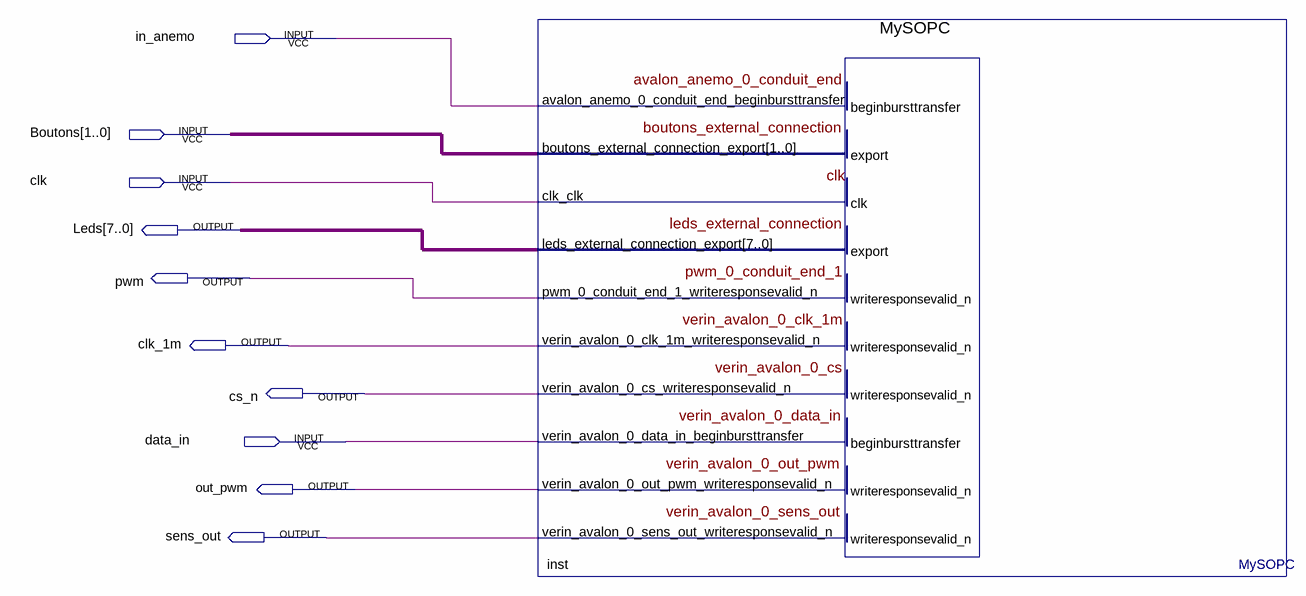
[diagram p0: schematic sheet]
// Quartus schematic Mon_Sopc.bdf as structural Verilog: 1 symbols, 10 pins
module Mon_Sopc (
  input  in_anemo,
  input  [1:0] Boutons,
  input  clk,
  input  data_in,
  output [7:0] Leds,
  output pwm,
  output clk_1m,
  output cs_n,
  output out_pwm,
  output sens_out
);

  MySOPC inst (
    .avalon_anemo_0_conduit_end_beginbursttransfer(in_anemo), .boutons_external_connection_export(Boutons),
    .clk_clk(clk), .verin_avalon_0_data_in_beginbursttransfer(data_in),
    .leds_external_connection_export(Leds), .pwm_0_conduit_end_1_writeresponsevalid_n(pwm),
    .verin_avalon_0_clk_1m_writeresponsevalid_n(clk_1m), .verin_avalon_0_cs_writeresponsevalid_n(cs_n),
    .verin_avalon_0_out_pwm_writeresponsevalid_n(out_pwm),
    .verin_avalon_0_sens_out_writeresponsevalid_n(sens_out));
endmodule
